# Altium project SDP.PrjPcb
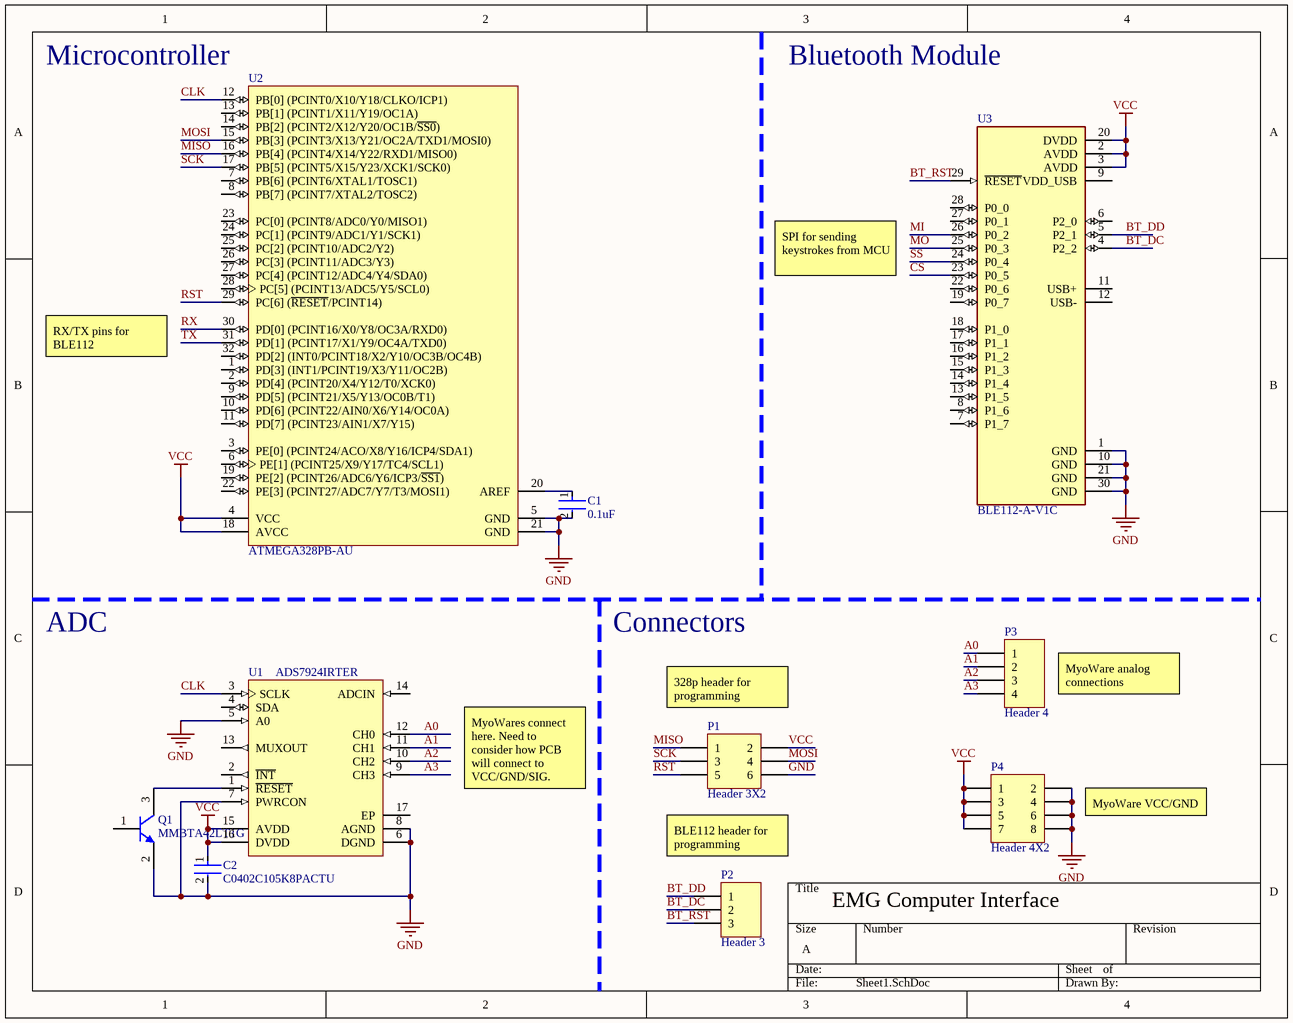
[diagram p0: Sheet1.SchDoc]
1 sheet, 10 parts. Net scope: global (net labels, ports and power ports of the same name join across sheets).
Board files: PCB_main.PcbDoc, MyoWareShape_PCB.PcbDoc

## Sheet Sheet1.SchDoc
size A; SheetNumber: 1; SheetTotal: 1

### Parts
C1  0.1uF  [FP-GRM033-0_03-IPC_C]
C2  C0402C105K8PACTU  [FP-C0402C105K8PACTU-MFG]
P1  Header 3X2  [HDR2X3]
P2  Header 3  [HDR1X3]
P3  Header 4  [HDR1X4]
P4  Header 4X2  [HDR2X4]
Q1  MMBTA42LT1G  [ONSC-SOT-23-3-318-08_V]
U1  ADS7924IRTER  [TI-RTE16-1700X1700TP_V]
U2  ATMEGA328PB-AU  [ATML-32A_L]
U3  BLE112-A-V1C  [BLUEGIGA_BLE112-A]

### Nets
GND: C1.2 C2.2 P1.6 P4.2 P4.4 P4.6 P4.8 Q1.2(E) U1.5(A0) U1.6(DGND) U1.7(PWRCON) U1.8(AGND) U2.5(GND) U2.21(GND) U3.1(GND) U3.10(GND) U3.21(GND) U3.30(GND)
VCC: C2.1 P1.2 P4.1 P4.3 P4.5 P4.7 U1.15(AVDD) U1.16(DVDD) U2.4(VCC) U2.18(AVCC) U3.2(AVDD) U3.3(AVDD) U3.20(DVDD)
A0: P3.1 U1.12(CH0)
A1: P3.2 U1.11(CH1)
A2: P3.3 U1.10(CH2)
A3: P3.4 U1.9(CH3)
BT_DC: P2.2 U3.4(P2_2)
BT_DD: P2.1 U3.5(P2_1)
BT_RST: P2.3 U3.29(~{RESET})
CLK: U1.3(SCLK) U2.12(PB[0]_(PCINT0/X10/Y18/CLKO/ICP1))
CS: U3.23(P0_5)
MI: U3.26(P0_2)
MISO: P1.1 U2.16(PB[4]_(PCINT4/X14/Y22/RXD1/MISO0))
MO: U3.25(P0_3)
MOSI: P1.4 U2.15(PB[3]_(PCINT3/X13/Y21/OC2A/TXD1/MOSI0))
RST: P1.5 U2.29(PC[6]_(~{RESET}/PCINT14))
RX: U2.30(PD[0]_(PCINT16/X0/Y8/OC3A/RXD0))
SCK: P1.3 U2.17(PB[5]_(PCINT5/X15/Y23/XCK1/SCK0))
SS: U3.24(P0_4)
TX: U2.31(PD[1]_(PCINT17/X1/Y9/OC4A/TXD0))
NetC1_1: C1.1 U2.20(AREF)
NetQ1_3: Q1.3(C) U1.1(~{RESET})

Not connected (* = marked no-connect by the designer): Q1 1(B); U1 2(~{INT}) 4(SDA) 13(MUXOUT) 14(ADCIN) 17(EP); U2 1(PD[3]_(INT1/PCINT19/X3/Y11/OC2B)) 2(PD[4]_(PCINT20/X4/Y12/T0/XCK0)) 3(PE[0]_(PCINT24/ACO/X8/Y16/ICP4/SDA1)) 6(PE[1]_(PCINT25/X9/Y17/TC4/SCL1)) 7(PB[6]_(PCINT6/XTAL1/TOSC1)) 8(PB[7]_(PCINT7/XTAL2/TOSC2)) 9(PD[5]_(PCINT21/X5/Y13/OC0B/T1)) 10(PD[6]_(PCINT22/AIN0/X6/Y14/OC0A)) 11(PD[7]_(PCINT23/AIN1/X7/Y15)) 13(PB[1]_(PCINT1/X11/Y19/OC1A)) 14(PB[2]_(PCINT2/X12/Y20/OC1B/~{SS0})) 19(PE[2]_(PCINT26/ADC6/Y6/ICP3/~{SS1})) 22(PE[3]_(PCINT27/ADC7/Y7/T3/MOSI1)) 23(PC[0]_(PCINT8/ADC0/Y0/MISO1)) 24(PC[1]_(PCINT9/ADC1/Y1/SCK1)) 25(PC[2]_(PCINT10/ADC2/Y2)) 26(PC[3]_(PCINT11/ADC3/Y3)) 27(PC[4]_(PCINT12/ADC4/Y4/SDA0)) 28(PC[5]_(PCINT13/ADC5/Y5/SCL0)) 32(PD[2]_(INT0/PCINT18/X2/Y10/OC3B/OC4B)); U3 6(P2_0) 7(P1_7) 8(P1_6) 9(VDD_USB) 11(USB+) 12(USB-) 13(P1_5) 14(P1_4) 15(P1_3) 16(P1_2) 17(P1_1) 18(P1_0) 19(P0_7) 22(P0_6) 27(P0_1) 28(P0_0)

### Notes on the sheet
- (near U2) Microcontroller
- Bluetooth Module
- SPI for sending keystrokes from MCU
- RX/TX pins for BLE112
- ADC
- Connectors
- (near P1) 328p header for programming
- MyoWare analog connections
- MyoWares connect here. Need to consider how PCB will connect to VCC/GND/SIG.
- (near P4) MyoWare VCC/GND
- BLE112 header for programming
- EMG Computer Interface

### Library data of the parts
C1 = CMP-2010-01264-2: Chip Multilayer Ceramic Capacitors for General Purpose, 0201, 0.10uF, X5R, 15%, 10%, 10V; Capacitance: 100nF; Mount: Surface Mount; Dielectric: X5R; Width: 0.012inch; Tolerance: 10%; Radiation Hardening: No; Voltage Rating: 10V; REACH SVHC: No SVHC; Height: 0.3mm; Max Operating Temperature: 85°C; Voltage Rating (DC): 10V; Thickness: 0.013inch; Termination: SMD/SMT; Lead Free: Lead Free; Package Quantity: 1; Case/Package: 0201; Min Operating Temperature: -55°C; Weight: 6E-06oz; Length: 0.6mm; Case Code (Imperial): 0201; Depth: 0.3mm; Voltage: 10V; Packaging: Tape and Reel; Case Code (Metric): 0603
C2 = CMP-2008-02081-2: CAP CER 1UF 10V X5R 0402; Dielectric Material: Ceramic; Dissipation Factor: 5%; Tolerance: 10%; Number of Pins: 2; Contact Plating: Tin; Min Operating Temperature: -55°C; Termination: SMD/SMT; Lead Free: Lead Free; Construction: Flat; Voltage Rating (DC): 10V; Mount: Surface Mount; Series: C; Thickness: 0.022inch; Width: 0.5mm; Radiation Hardening: No; Capacitance: 1uF; Dielectric: X5R; Height: 0.5mm; Voltage: 10V; Length: 1mm; Depth: 0.5mm; Max Operating Temperature: 85°C; Package Quantity: 1; Packaging: Tape and Reel; RoHS Compliant: Yes; Case Code (Imperial): 0402; Case Code (Metric): 1005; REACH SVHC: No SVHC; Voltage Rating: 10V; Case/Package: 0402
P1 = Header 3X2: Header, 3-Pin, Dual row; LatestRevisionDate: 17-Jul-2002; LatestRevisionNote: Re-released for DXP Platform.; Publisher: Altium Limited
P2 = Header 3: Header, 3-Pin; LatestRevisionDate: 17-Jul-2002; LatestRevisionNote: Re-released for DXP Platform.; Publisher: Altium Limited
P3 = Header 4: Header, 4-Pin; LatestRevisionDate: 17-Jul-2002; LatestRevisionNote: Re-released for DXP Platform.; Publisher: Altium Limited
P4 = Header 4X2: Header, 4-Pin, Dual row; LatestRevisionDate: 17-Jul-2002; LatestRevisionNote: Re-released for DXP Platform.; Publisher: Altium Limited
Q1 = CMP-1048-00662-1: High Voltage Transistor, NPN Silicon, 3-Pin SOT-23, Pb-Free, Tape and Reel; Manufacturer: On Semiconductor; fT Min (MHz): 50; IC Continuous (A): 0.5; ComponentLink1URL: http://www.onsemi.com/; ComponentLink3URL: http://www.onsemi.cn/pub_link/Collateral/318-08.PDF; RoHS: TRUE; ComponentLink2Description: Datasheet; PartNumber: MMBTA42LT1G; Polarity: NPN; DatasheetVersion: Rev. 12; PackageReference: SOT-23-3-318-08; PackageDescription: 3-Pin Small Outline Transistor, Body 2.92 x 1.3 mm, Pitch 0.95 mm; ComponentLink3Description: Package Specification; ComponentLink1Description: Manufacturer URL; Packing: Tape and Reel; PackageVersion: Rev. AP, 11/2009; Mounting Technology: Surface Mount; ComponentLink2URL: http://www.onsemi.cn/pub_link/Collateral/MMBTA42LT1-D.PDF
U1 = CMP-0003-02167-1: 12-Bit, 4-Channel Mux Input SAR ADC with Intelligent System Power Control, -40 to 85 degC, 16-pin QFN (RTE16), Green (RoHS & no Sb/Br); Manufacturer: Texas Instruments; Digital Supply(Max)(V): 5.5; INL(Max)(+/-LSB): 1.5; Sample Rate (max)(SPS): 100k; # Input Channels: 4; Analog Voltage AV/DD(Min)(V): 2.2; Resolution(Bits): 12; Interface: Serial I2C; SubFamily: Precision ADC (<=10MSPS); Digital Supply(Min)(V): 1.65; Analog Voltage AV/DD(Max)(V): 5.5; ComponentLink3URL: http://www.ti.com/litv/pdf/mpqf149c; ComponentLink3Description: Package Specification; PartNumber: ADS7924IRTER; Mounting Technology: Surface Mount; PackageReference: RTE16-1700X1700TP; ComponentLink1URL: http://www.ti.com/; PackageDescription: 16-Pin Plastic Flat Pack, Body 3 x 3 mm, Pitch 0.5 mm; ComponentLink2Description: Datasheet; Architecture: SAR; ComponentLink2URL: http://www.ti.com/general/docs/lit/getliterature.tsp?genericPartNumber=ADS7924&fileType=pdf; Code_JEDEC: MO-220; DatasheetVersion: SBAS482A; Eco-Plan: Green (RoHS & no Sb/Br); ComponentLink1Description: Manufacturer URL; PackageVersion: 4205254/D, 01/2011
U2 = CMP-2000-07439-1: AVR Microcontroller, 1.8 to 5.5 V, 32 KB Flash, 1 KB EEPROM, 2 KB SRAM, -40 to 85 degC, 32-Pin TQFP (32A), RoHS, Tray; Manufacturer: Microchip; Datasheet URL: http://ww1.microchip.com/downloads/en/DeviceDoc/40001906A.pdf; Mounting Technology: SurfaceMount; RoHSCompliant: false; Manufacturer URL: http://www.microchip.com/; Package Description: 32-Pin Thin Profile Plastic Quad Flat Package, Body 7 x 7 mm, Pitch 0.8 mm; Package Reference: 32A; Datasheet Version: Rev. A, 04/2017
U3 = BLE112-A-V1C: Low Energy Bluetooth Module; Package: None; Price: None; Value: *; MP: BLE112-A-V1C; Availability: Unavailable